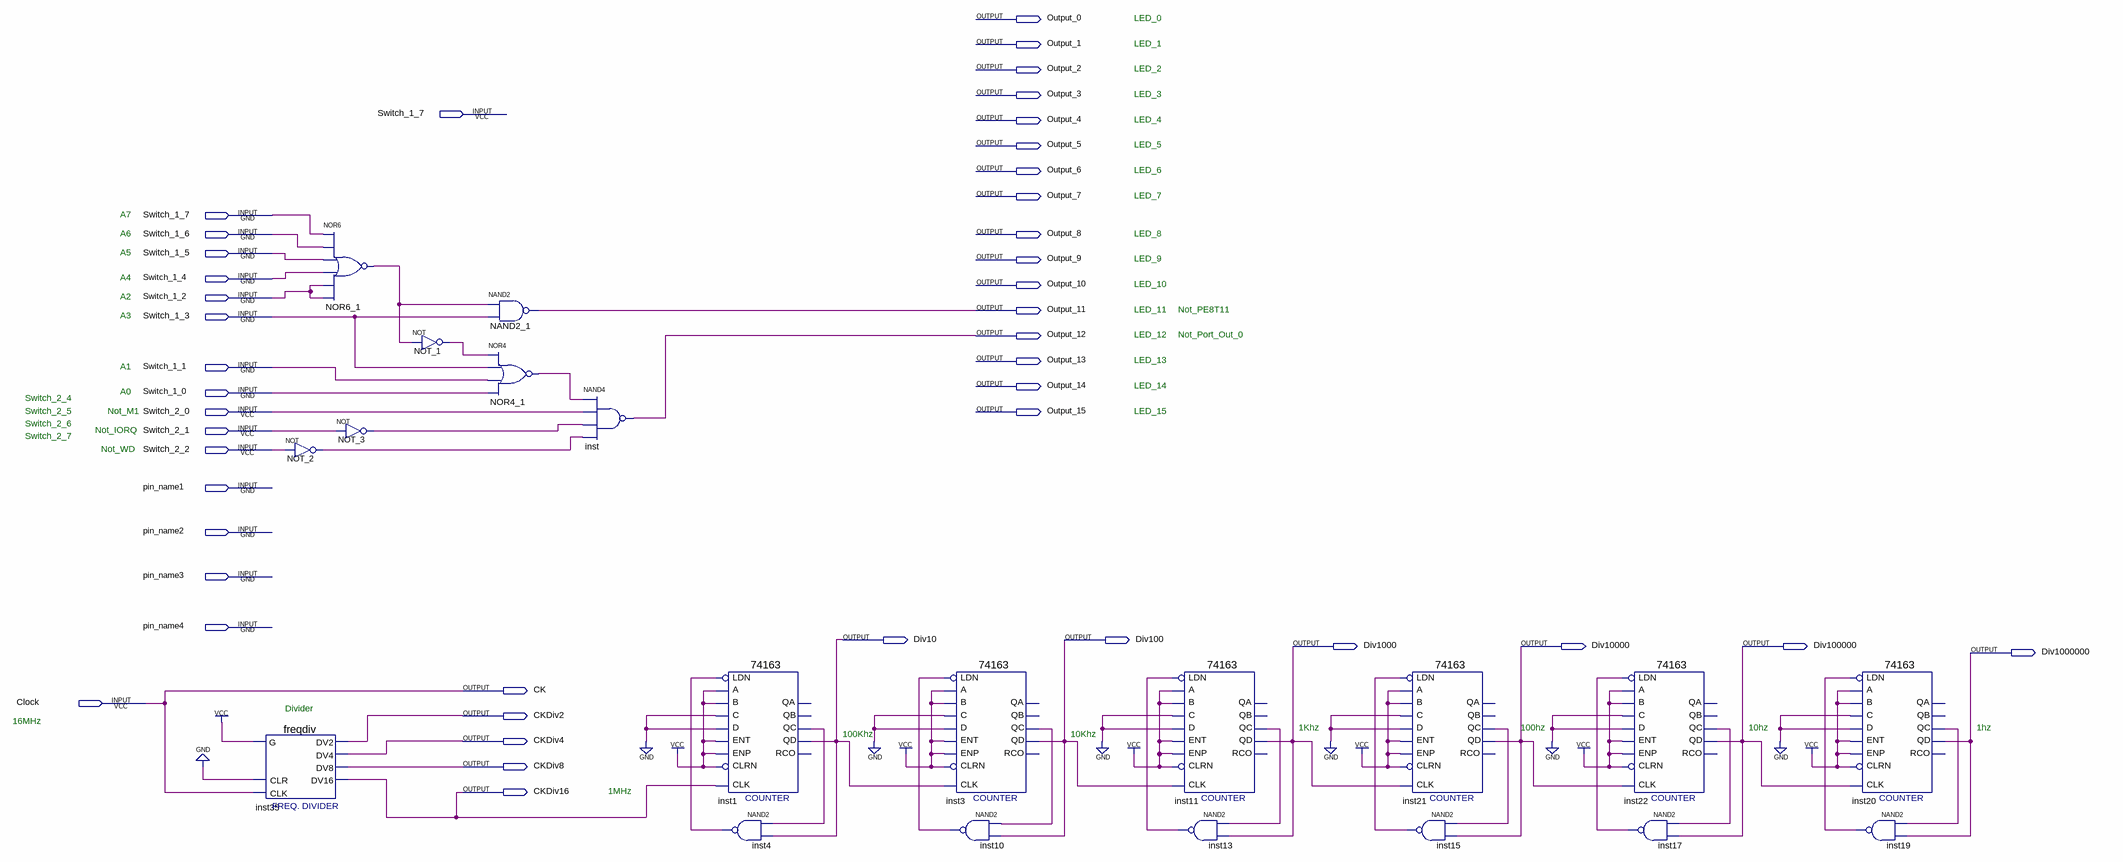
[diagram p0: schematic sheet]
// Quartus schematic 7-Seg.bdf as structural Verilog: 20 symbols, 44 pins
module \7-Seg  (
  input  Switch_1_7,
  input  Switch_1_6,
  input  Switch_1_5,
  input  Switch_1_4,
  input  Switch_1_2,
  input  Switch_1_3,
  input  Switch_1_1,
  input  Switch_1_0,
  input  Switch_2_0,
  input  Switch_2_1,
  input  Switch_2_2,
  input  pin_name1,
  input  pin_name2,
  input  pin_name3,
  input  pin_name4,
  input  Clock,
  output Output_0,
  output Output_1,
  output Output_2,
  output Output_3,
  output Output_4,
  output Output_5,
  output Output_6,
  output Output_7,
  output Output_8,
  output Output_9,
  output Output_10,
  output Output_11,
  output Output_12,
  output Output_13,
  output Output_14,
  output Output_15,
  output Div10,
  output Div100,
  output Div1000,
  output Div10000,
  output Div100000,
  output Div1000000,
  output CK,
  output CKDiv2,
  output CKDiv4,
  output CKDiv8,
  output CKDiv16
);

  wire inst1_qc, inst3_qc, inst4_out, inst10_out, inst11_qc, inst13_out, inst15_out, inst17_out, inst19_out,
       inst20_qc, inst21_qc, inst22_qc, NOR4_1_out, NOR6_1_out, NOT_1_out, NOT_2_out, NOT_3_out;

  freqdiv inst35 (.CLK(Clock), .CLR(1'b0), .G(1'b1), .DV2(CKDiv2), .DV4(CKDiv4), .DV8(CKDiv8), .DV16(CKDiv16));
  not NOT_2 (NOT_2_out, Switch_2_2);
  nor NOR6_1 (NOR6_1_out, Switch_1_7, Switch_1_6, Switch_1_5, Switch_1_4, Switch_1_2, Switch_1_2);
  not NOT_3 (NOT_3_out, Switch_2_1);
  not NOT_1 (NOT_1_out, NOR6_1_out);
  nand NAND2_1 (Output_11, NOR6_1_out, Switch_1_3);
  nor NOR4_1 (NOR4_1_out, NOT_1_out, Switch_1_3, Switch_1_1, Switch_1_0);
  nand inst (Output_12, NOR4_1_out, Switch_2_0, NOT_3_out, NOT_2_out);
  \74163  inst1 (
    .C(1'b0), .B(1'b1), .A(1'b1), .ENT(1'b1), .D(1'b0), .CLRN(1'b1), .CLK(CKDiv16), .ENP(1'b1),
    .LDN(inst4_out), .QC(inst1_qc), .QD(Div10));  // open: QA, QB, RCO
  nand inst4 (inst4_out, inst1_qc, Div10);
  \74163  inst3 (
    .C(1'b0), .B(1'b1), .A(1'b1), .ENT(1'b1), .D(1'b0), .CLRN(1'b1), .CLK(Div10), .ENP(1'b1),
    .LDN(inst10_out), .QC(inst3_qc), .QD(Div100));  // open: QA, QB, RCO
  nand inst10 (inst10_out, inst3_qc, Div100);
  \74163  inst11 (
    .C(1'b0), .B(1'b1), .A(1'b1), .ENT(1'b1), .D(1'b0), .CLRN(1'b1), .CLK(Div100), .ENP(1'b1),
    .LDN(inst13_out), .QC(inst11_qc), .QD(Div1000));  // open: QA, QB, RCO
  nand inst13 (inst13_out, inst11_qc, Div1000);
  \74163  inst21 (
    .C(1'b0), .B(1'b1), .A(1'b1), .ENT(1'b1), .D(1'b0), .CLRN(1'b1), .CLK(Div1000), .ENP(1'b1),
    .LDN(inst15_out), .QC(inst21_qc), .QD(Div10000));  // open: QA, QB, RCO
  nand inst15 (inst15_out, inst21_qc, Div10000);
  \74163  inst22 (
    .C(1'b0), .B(1'b1), .A(1'b1), .ENT(1'b1), .D(1'b0), .CLRN(1'b1), .CLK(Div10000), .ENP(1'b1),
    .LDN(inst17_out), .QC(inst22_qc), .QD(Div100000));  // open: QA, QB, RCO
  nand inst17 (inst17_out, inst22_qc, Div100000);
  \74163  inst20 (
    .C(1'b0), .B(1'b1), .A(1'b1), .ENT(1'b1), .D(1'b0), .CLRN(1'b1), .CLK(Div100000), .ENP(1'b1),
    .LDN(inst19_out), .QC(inst20_qc), .QD(Div1000000));  // open: QA, QB, RCO
  nand inst19 (inst19_out, inst20_qc, Div1000000);

  assign CK = Clock;

  // Notes on the sheet:
  //   LED_0
  //   LED_1
  //   LED_2
  //   LED_3
  //   LED_4
  //   LED_5
  //   LED_6
  //   LED_7
  //   A7
  //   A6
  //   LED_8
  //   A5
  //   LED_9
  //   A4
  //   LED_10
  //   A2
  //   LED_11
  //   Not_PE8T11
  //   A3
  //   LED_12
  //   Not_Port_Out_0
  //   LED_13
  //   A1
  //   LED_14
  //   A0
  //   Switch_2_4
  //   Switch_2_5
  //   Not_M1
  //   LED_15
  //   Switch_2_6
  //   Not_IORQ
  //   Switch_2_7
  //   Not_WD
  //   Divider
  //   16MHz
  //   1Khz
  //   100hz
  //   10hz
  //   1hz
  //   100Khz
  //   10Khz
  //   1MHz
endmodule
